# Altium schematic sheet main.SchDoc: AudioBound - Main
size Letter; CheckedBy: J. Brinton; CompanyName: Brinton Engineering, LLC; DrawnBy: J. Brinton; Engineer: J. Brinton; Address1: 3479 Edison Way; Address2: Menlo Park CA 94025; Revision: 1; SheetNumber: 1; SheetTotal: 1
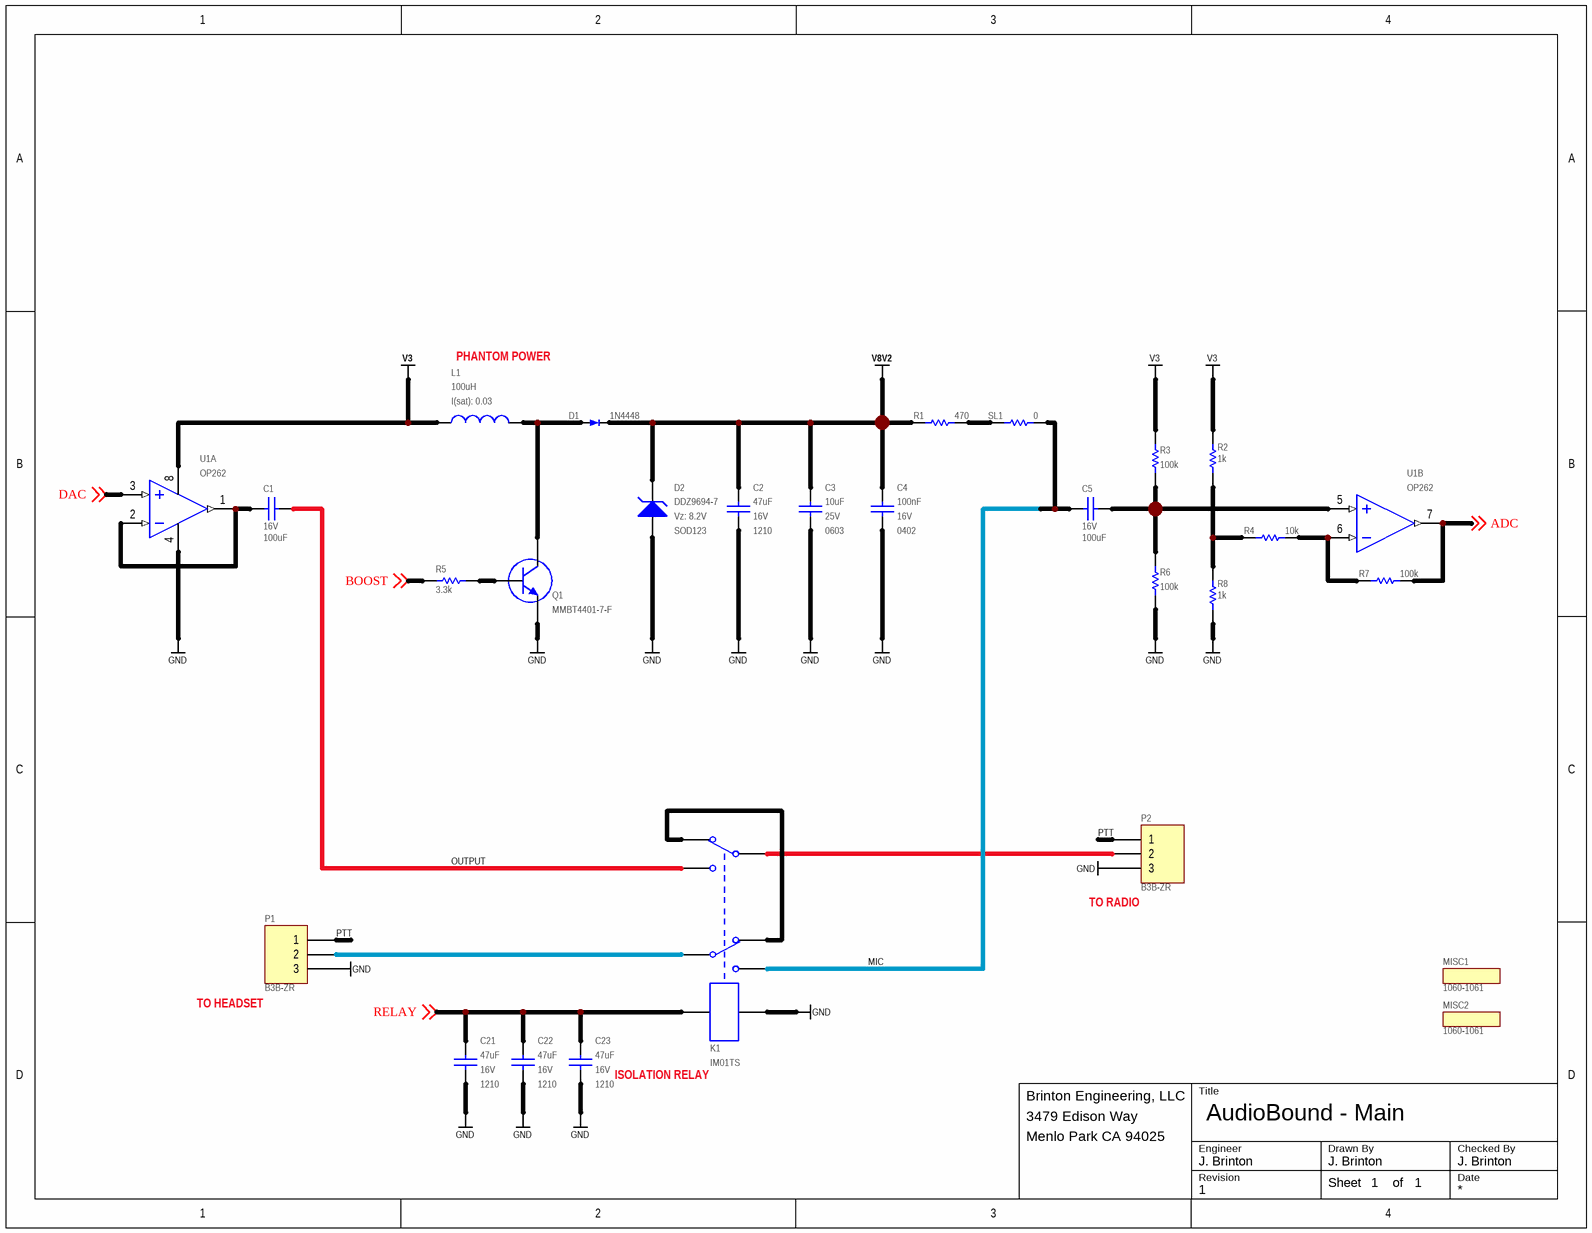
[diagram p0: main.SchDoc]

## Parts
C1  value 100uF  Voltage: 16V  [CAPC7563X300L40N]  (hidden comment: C7563X7S1C107M280LE)
C2  value 47uF  Voltage: 16V  [1210]  (hidden comment: GRM32EC81C476KE15L)
C3  value 10uF  Voltage: 25V  [0603]  (hidden comment: CL10A106MA8NRNC)
C4  value 100nF  Voltage: 16V  [0402]  (hidden comment: GRM155R71C104KA88J)
C5  value 100uF  Voltage: 16V  [CAPC7563X300L40N]  (hidden comment: C7563X7S1C107M280LE)
C21  value 47uF  Voltage: 16V  [1210]  (hidden comment: GRM32EC81C476KE15L)
C22  value 47uF  Voltage: 16V  [1210]  (hidden comment: GRM32EC81C476KE15L)
C23  value 47uF  Voltage: 16V  [1210]  (hidden comment: GRM32EC81C476KE15L)
D1  Alternative P/N: 1N4448  [SOD323]  (hidden comment: 1N4448HWS-7-F)
D2  DDZ9694-7  Vz: 8.2V  [SOD123]
K1  IM01TS  [IM01TS]
L1  value 100uH  I(sat): 0.03  [0805]  (hidden comment: KLZ2012NHR101LTD25)
MISC1  1060-1061  (mechanical)
MISC2  1060-1061  (mechanical)
P1  B3B-ZR  [B3B-ZR]  (no BOM)
P2  B3B-ZR  [B3B-ZR]  (no BOM)
Q1  MMBT4401-7-F  [SOT23]
R1  value 470  [RESC1005X40N]  (hidden comment: ERJ-2RKF4700X)
R2  value 1k  [RESC1005X40N]  (hidden comment: ERJ-2RKF1001X)
R3  value 100k  [RESC1005X40N]  (hidden comment: ERJ-2RKF1003X)
R4  value 10k  [RESC1005X40N]  (hidden comment: ERJ-2RKF1002X)
R5  value 3.3k  [RESC1005X40N]  (hidden comment: ERJ-2RKF3301X)
R6  value 100k  [RESC1005X40N]  (hidden comment: ERJ-2RKF1003X)
R7  value 100k  [RESC1005X40N]  (hidden comment: ERJ-2RKF1003X)
R8  value 1k  [RESC1005X40N]  (hidden comment: ERJ-2RKF1001X)
SL1  value 0  [SOLDERLINK0603X26N_BRIDGED]  (hidden comment: SOLDER_LINK_BRIDGED)  (no BOM)
U1  OP262  [TSSOP8]  (parts A,B of 2)

## Nets
GND: C2.1 C3.1 C4.2 C21.1 C22.1 C23.1 D2.1(A) K1.8 P1.3 P2.3 Q1.2(E) R6.1 R8.1 U1.4(V-)
V3: L1.1 R2.2 R3.2 U1.8(V+)
V8V2: C2.2 C3.2 C4.1 D1.K D2.2(C) R1.2
ADC: R7.1 U1.7(OUTB) ; off-sheet ADC
BOOST: R5.2 ; off-sheet BOOST
DAC: U1.3(INA+) ; off-sheet DAC
MIC: C5.2 K1.4 SL1.2
OUTPUT: C1.1 K1.5
PTT: P1.1 P2.1
RELAY: C21.2 C22.2 C23.2 K1.1 ; off-sheet RELAY
NetC1_2: C1.2 U1.1(OUTA) U1.2(INA-)
NetC5_1: C5.1 R3.1 R6.2 U1.5(INB+)
NetD1_A: D1.A L1.2 Q1.3(C)
NetK1_2: K1.2 K1.7
NetK1_3: K1.3 P1.2
NetK1_6: K1.6 P2.2
NetQ1_1: Q1.1(B) R5.1
NetR1_1: R1.1 SL1.1
NetR2_1: R2.1 R4.2 R8.2
NetR4_1: R4.1 R7.2 U1.6(INB-)

## Notes on the sheet
- PHANTOM POWER
- (near P2) TO RADIO
- (near P1) TO HEADSET
- ISOLATION RELAY
- Title
- Engineer
- Revision
- Drawn By
- Checked By
- Date
- Sheet
- of

## Library data of the parts
C1 C5 = CAP: Ceramic Capacitor 100uF ±20% 16V X7S 3025; Manufacturer: TDK; Tr: -55:125; Manufacturer P/N: C7563X7S1C107M280LE; Tolerance: ±20%; Package: 3025
C2 C21-C23 = CAP: Ceramic Capacitor 47uF ±10% 16V X6S 1210; Manufacturer: Murata; Tr: -55:105; Manufacturer P/N: GRM32EC81C476KE15L; Tolerance: ±10%; Footprint: *; Package: 1210
C3 = CAP 0603: Ceramic Capacitor 10uF ±20% 25V X5R 0603; Manufacturer: Samsung; Tr: -55:85; Manufacturer P/N: CL10A106MA8NRNC; Package: 0603; Tolerance: ±20%
C4 = CAP 0402: Ceramic Capacitor 100nF ±10% 16V X7R 0402; Manufacturer: Murata; Tr: -55:125; Manufacturer P/N: GRM155R71C104KA88J; Package: 0402; Tolerance: ±10%
D1 = 1N4448HWS-7-F: Schottky Diode 80V 250mA SOD323; Manufacturer: Diodes, Inc.; Manufacturer P/N: 1N4448HWS-7-F
D2 = DDZ9694-7: Zener Diode 8.2V 500mW SOD123; Manufacturer: Diodes, Inc.; Manufacturer P/N: DDZ9694-7; Package: SOD123
K1 = IM01TS: Dual-Pole Dual-Throw Relay; Manufacturer: TE Connectivity; Manufacturer: IM01TS
L1 = INDUCTOR: Inductor 100uH ±20% 140mA 0805; Manufacturer: TDK; Tr: -55:150; Manufacturer P/N: KLZ2012NHR101LTD25; Package: 0805; Tolerance: ±20%
MISC1 MISC2 = M50-1900005: Strain Relief Bushing; Manufacturer: Heyco; Do Not Place: PURCHASE BUT DNP; Manufacturer P/N: 1060-1061
P1 P2 = Header 3: Header, 3-Pin; Manufacturer: JST; Manufacturer P/N: B3B-ZR
Q1 = MMBT4401-7-F: NPN Small Signal Transistor SMD SOT-23; Manufacturer: Diodes, Inc.; Manufacturer P/N: MMBT4401-7-F
R1 = RES: Thick Film Resistor 470 ±1% 0.1W 50V 0402; Manufacturer: Panasonic; Tcr: ±100; Tr: -55:155; Voltage: 50; Power: 0.1; Manufacturer P/N: ERJ-2RKF4700X; Tolerance: ±1%; Alternatives: *; Footprint: *; Package: 0402
R2 R8 = RES: Thick Film Resistor 1k ±1% 0.1W 50V 0402; Manufacturer: Panasonic; Tcr: ±100; Tr: -55:155; Voltage: 50; Power: 0.1; Manufacturer P/N: ERJ-2RKF1001X; Tolerance: ±1%; Alternatives: *; Footprint: *; Package: 0402
R3 R6 R7 = RES: Thick Film Resistor 100k ±1% 0.1W 50V 0402; Manufacturer: Panasonic; Tcr: ±100; Tr: -55:155; Voltage: 50; Power: 0.1; Manufacturer P/N: ERJ-2RKF1003X; Tolerance: ±1%; Alternatives: *; Footprint: *; Package: 0402
R4 = RES: Thick Film Resistor 10k ±1% 0.1W 50V 0402; Manufacturer: Panasonic; Tcr: ±100; Tr: -55:155; Voltage: 50; Power: 0.1; Manufacturer P/N: ERJ-2RKF1002X; Tolerance: ±1%; Alternatives: *; Footprint: *; Package: 0402
R5 = RES: Thick Film Resistor 3.3k ±1% 0.1W 50V 0402; Manufacturer: Panasonic; Tcr: ±100; Tr: -55:155; Voltage: 50; Power: 0.1; Manufacturer P/N: ERJ-2RKF3301X; Tolerance: ±1%; Alternatives: *; Footprint: *; Package: 0402
SL1 = RES: Solder Link Bridged; Manufacturer P/N: *; Manufacturer: *
U1 = OP262: Dual 15 MHz Rail-to-Rail Op Amp; Manufacturer P/N: OP262HRU; Manufacturer: Analog Devices